# Altium schematic sheet 4-PWR_MANAGE_3.SCHDOC
size A4
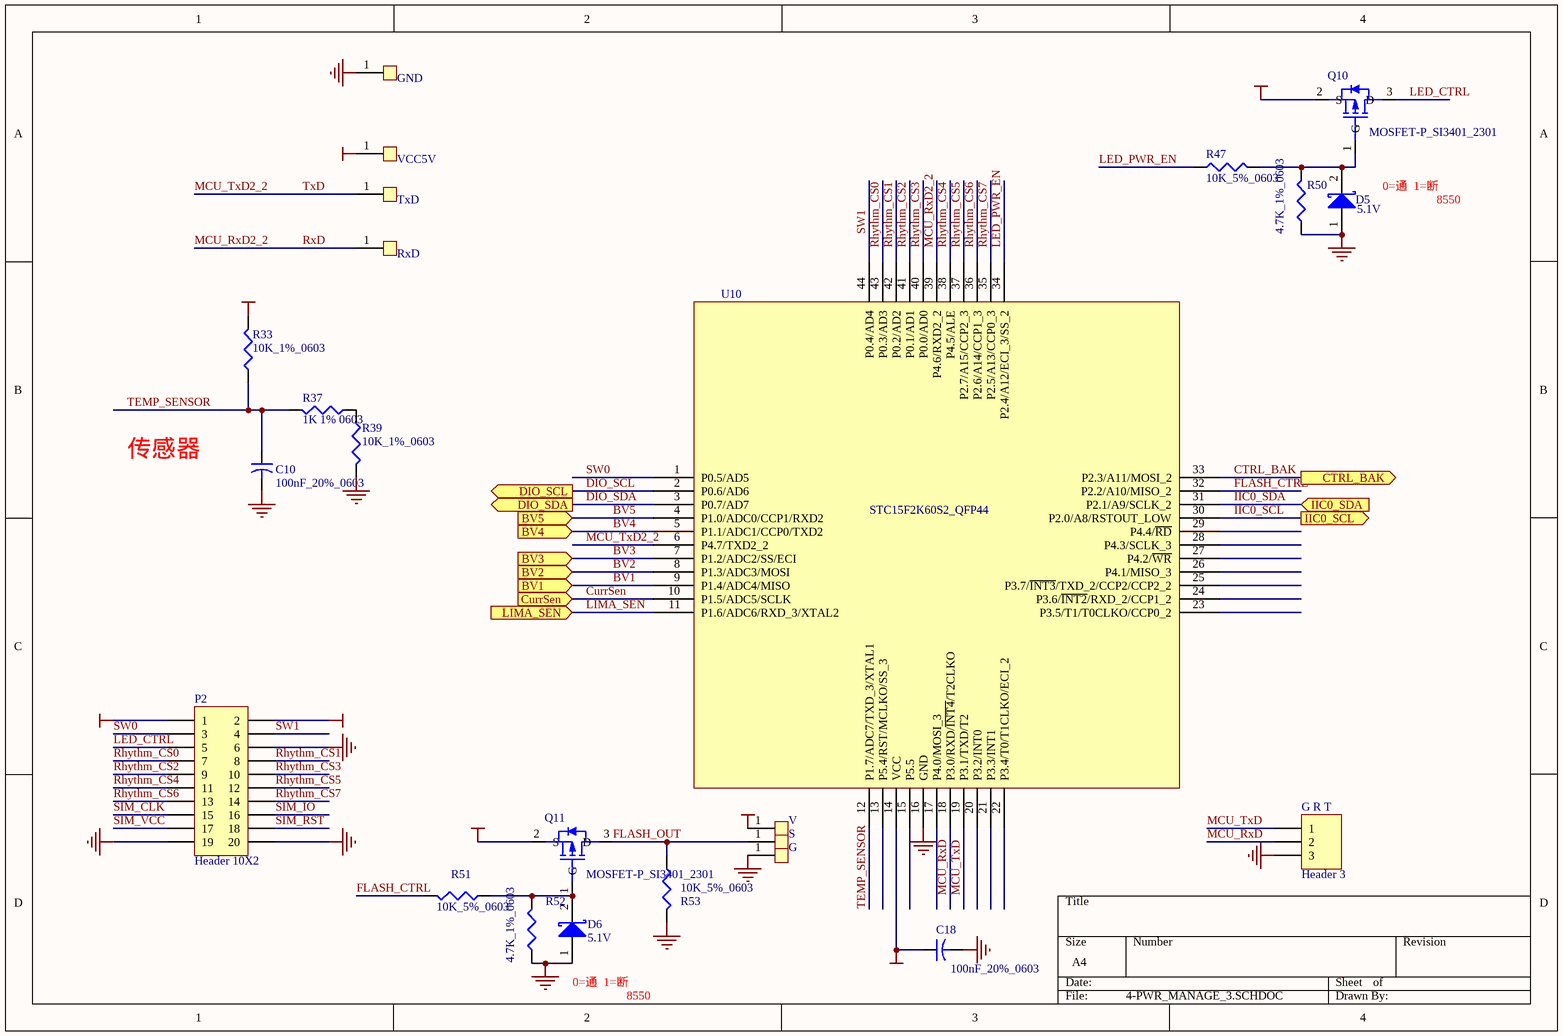
[diagram p0: 4-PWR_MANAGE_3.SCHDOC]

## Parts
C10  100nF_20%_0603  [C1608-0603]
C18  100nF_20%_0603  [C1608-0603]
D5  5.1V  [LED0805]
D6  5.1V  [LED0805]
G  ND  [END_1.5_2.8]  (value not drawn)
G_R_T  Header 3  [XH-03H]
GND  ND  [END_3_6]  (value not drawn)
P2  Header 10X2  [HDR2X10]
Q10  MOSFET-P_SI3401_2301  [SO-G3/C2.5]
Q11  MOSFET-P_SI3401_2301  [SO-G3/C2.5]
R33  value 10K_1%_0603  [C1608-0603]  (hidden comment: 10K_5%_0603)
R37  value 1K 1% 0603  [C1608-0603]  (hidden comment: 1K_5%_0603)
R39  value 10K_1%_0603  [C1608-0603]  (hidden comment: 1K_5%_0603)
R47  10K_5%_0603  [C1608-0603]
R50  4.7K_1%_0603  [C1608-0603]
R51  10K_5%_0603  [C1608-0603]
R52  4.7K_1%_0603  [C1608-0603]
R53  10K_5%_0603  [C1608-0603]
RxD  ND  [END_3_6]  (value not drawn)
S  ND  [END_1.5_2.8]  (value not drawn)
TxD  ND  [END_3_6]  (value not drawn)
U10  STC15F2K60S2_QFP44  [PQFP44]
V  ND  [END_1.5_2.8]  (value not drawn)
VCC5V  ND  [END_3_6]  (value not drawn)

## Ports
BV1 (in), BV2 (in), BV3 (in), BV4 (in), BV5 (in), CTRL_BAK (out), CurrSen (in), DIO_SCL (out), DIO_SDA (out), IIC0_SCL (out), IIC0_SDA (in), LIMA_SEN (in)

## Nets
GND: C10.2 C18.2 D5.1(A) D6.1(A) G.1(SW) G_R_T.3 GND.1(SW) P2.6 P2.19 P2.20 R39.2 R50.1 R52.1 R53.2 U10.16(GND)
VCC_3V3: C18.1 P2.1 P2.2 Q10.2(S) Q11.2(S) R33.2 U10.14(VCC)
VCC_5V: VCC5V.1(SW)
VCC_BAT: V.1(SW)
BV1: U10.9(P1.4/ADC4/MISO) ; port BV1
BV2: U10.8(P1.3/ADC3/MOSI) ; port BV2
BV3: U10.7(P1.2/ADC2/SS/ECI) ; port BV3
BV4: U10.5(P1.1/ADC1/CCP0/TXD2) ; port BV4
BV5: U10.4(P1.0/ADC0/CCP1/RXD2) ; port BV5
CTRL_BAK: U10.33(P2.3/A11/MOSI_2) ; port CTRL_BAK
CurrSen: U10.10(P1.5/ADC5/SCLK) ; port CurrSen
DIO_SCL: U10.2(P0.6/AD6) ; port DIO_SCL
DIO_SDA: U10.3(P0.7/AD7) ; port DIO_SDA
FLASH_CTRL: R51.2 U10.32(P2.2/A10/MISO_2)
FLASH_OUT: Q11.3(D) R53.1 S.1(SW)
IIC0_SCL: U10.30(P2.0/A8/RSTOUT_LOW) ; port IIC0_SCL
IIC0_SDA: U10.31(P2.1/A9/SCLK_2) ; port IIC0_SDA
LED_CTRL: P2.5 Q10.3(D)
LED_PWR_EN: R47.1 U10.34(P2.4/A12/ECI_3/SS_2)
LIMA_SEN: U10.11(P1.6/ADC6/RXD_3/XTAL2) ; port LIMA_SEN
MCU_RxD: G_R_T.2 U10.18(P3.0/RXD/~{INT4}/T2CLKO)
MCU_RxD2_2: RxD.1(SW) U10.39(P4.6/RXD2_2)  [also labelled RxD]
MCU_TxD: G_R_T.1 U10.19(P3.1/TXD/T2)
MCU_TxD2_2: TxD.1(SW) U10.6(P4.7/TXD2_2)  [also labelled TxD]
Rhythm_CS0: P2.7 U10.43(P0.3/AD3)
Rhythm_CS1: P2.8 U10.42(P0.2/AD2)
Rhythm_CS2: P2.9 U10.41(P0.1/AD1)
Rhythm_CS3: P2.10 U10.40(P0.0/AD0)
Rhythm_CS4: P2.11 U10.38(P4.5/ALE)
Rhythm_CS5: P2.12 U10.37(P2.7/A15/CCP2_3)
Rhythm_CS6: P2.13 U10.36(P2.6/A14/CCP1_3)
Rhythm_CS7: P2.14 U10.35(P2.5/A13/CCP0_3)
SIM_CLK: P2.15
SIM_IO: P2.16
SIM_RST: P2.18
SIM_VCC: P2.17
SW0: P2.3 U10.1(P0.5/AD5)
SW1: P2.4 U10.44(P0.4/AD4)
TEMP_SENSOR: C10.1 R33.1 R37.2 U10.12(P1.7/ADC7/TXD_3/XTAL1)
NetD5_2: D5.2(K) Q10.1(G) R47.2 R50.2
NetD6_2: D6.2(K) Q11.1(G) R51.1 R52.2
NetR37_1: R37.1 R39.1

Not connected (* = marked no-connect by the designer): U10 13(P5.4/RST/MCLKO/SS_3) 15(P5.5) 17(P4.0/MOSI_3) 20(P3.2/INT0) 21(P3.3/INT1) 22(P3.4/T0/T1CLKO/ECI_2) 23(P3.5/T1/T0CLKO/CCP0_2) 24(P3.6/~{INT2}/RXD_2/CCP1_2) 25(P3.7/~{INT3}/TXD_2/CCP2/CCP2_2) 26(P4.1/MISO_3) 27(P4.2/~{WR}) 28(P4.3/SCLK_3) 29(P4.4/~{RD})

## Notes on the sheet
- 0=通  1=断
- 8550
- 传感器

## Library data of the parts
C10 = Cap2: Capacitor; Published: 23-Sep-2002; Publisher: Altium Limited; Value: 100nF_20%_0603
C18 = Cap2: Capacitor; Value: 0.1uF 20% 0603; Published: 23-Sep-2002; Publisher: Altium Limited
D5 D6 = D Schottky: Schottky Diode; Code - JEDEC: DO-214-AA; Published: 8-Jun-2000; Revision: July-2002: Re-released for DXP Platform.; Publisher: Altium Limited
G_R_T = Header 3: Header, 3-Pin; LatestRevisionDate: 17-Jul-2002; LatestRevisionNote: Re-released for DXP Platform.; Publisher: Altium Limited
P2 = Header 10X2: Header, 10-Pin, Dual row; LatestRevisionDate: 17-Jul-2002; LatestRevisionNote: Re-released for DXP Platform.; Publisher: Altium Limited
Q10 Q11 = MOSFET-P
R33 R37 R39 = Res3: Resistor; Published: 8-Jun-2000; Revision: July-2002: Re-released for DXP Platform.; Publisher: Altium Limited
R47 R50-R53 = Res3: Resistor; Value: 1K%5 0603; Published: 8-Jun-2000; Revision: July-2002: Re-released for DXP Platform.; Publisher: Altium Limited